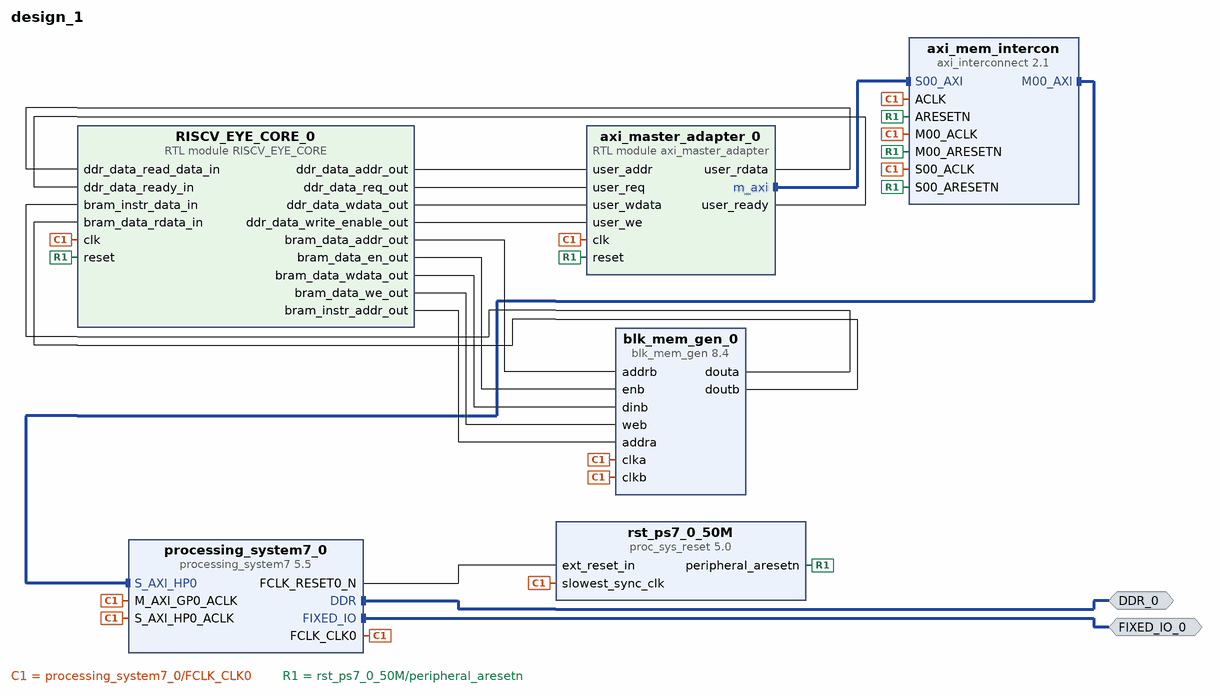
[diagram p0: block diagram of the top level]
# Vivado block design design_1, xc7z020clg400-1, Vivado 2024.2
create_bd_design design_1

create_bd_intf_port -mode Master -vlnv xilinx.com:interface:ddrx_rtl:1.0 DDR_0
create_bd_intf_port -mode Master -vlnv xilinx.com:display_processing_system7:fixedio_rtl:1.0 FIXED_IO_0

create_bd_cell -type ip -vlnv xilinx.com:ip:blk_mem_gen:8.4 blk_mem_gen_0
set_property -dict [list \
  CONFIG.Assume_Synchronous_Clk false \
  CONFIG.Coe_File test.coe \
  CONFIG.Fill_Remaining_Memory_Locations false \
  CONFIG.Load_Init_File true \
  CONFIG.Memory_Type True_Dual_Port_RAM \
  CONFIG.Write_Depth_A 1024 \
  CONFIG.use_bram_block Stand_Alone \
] [get_bd_cells blk_mem_gen_0]
create_bd_cell -type module -reference axi_master_adapter axi_master_adapter_0
create_bd_cell -type ip -vlnv xilinx.com:ip:processing_system7:5.5 processing_system7_0
set_property -dict [list \
  CONFIG.PCW_APU_PERIPHERAL_FREQMHZ 667 \
  CONFIG.PCW_ENET0_ENET0_IO {MIO 16 .. 27} \
  CONFIG.PCW_ENET0_GRP_MDIO_ENABLE 1 \
  CONFIG.PCW_ENET0_GRP_MDIO_IO {MIO 52 .. 53} \
  CONFIG.PCW_ENET0_PERIPHERAL_ENABLE 1 \
  CONFIG.PCW_ENET0_RESET_ENABLE 0 \
  CONFIG.PCW_ENET_RESET_ENABLE 1 \
  CONFIG.PCW_ENET_RESET_SELECT {Share reset pin} \
  CONFIG.PCW_FPGA0_PERIPHERAL_FREQMHZ 50 \
  CONFIG.PCW_GPIO_MIO_GPIO_ENABLE 1 \
  CONFIG.PCW_GPIO_MIO_GPIO_IO MIO \
  CONFIG.PCW_I2C_RESET_ENABLE 1 \
  CONFIG.PCW_PRESET_BANK1_VOLTAGE {LVCMOS 1.8V} \
  CONFIG.PCW_QSPI_GRP_FBCLK_ENABLE 1 \
  CONFIG.PCW_QSPI_GRP_FBCLK_IO {MIO 8} \
  CONFIG.PCW_QSPI_GRP_SINGLE_SS_ENABLE 1 \
  CONFIG.PCW_QSPI_GRP_SINGLE_SS_IO {MIO 1 .. 6} \
  CONFIG.PCW_QSPI_PERIPHERAL_ENABLE 1 \
  CONFIG.PCW_QSPI_QSPI_IO {MIO 1 .. 6} \
  CONFIG.PCW_SD0_GRP_CD_ENABLE 1 \
  CONFIG.PCW_SD0_GRP_CD_IO {MIO 47} \
  CONFIG.PCW_SD0_GRP_WP_ENABLE 0 \
  CONFIG.PCW_SD0_PERIPHERAL_ENABLE 1 \
  CONFIG.PCW_SD0_SD0_IO {MIO 40 .. 45} \
  CONFIG.PCW_SDIO_PERIPHERAL_FREQMHZ 50 \
  CONFIG.PCW_SINGLE_QSPI_DATA_MODE x4 \
  CONFIG.PCW_UART1_PERIPHERAL_ENABLE 1 \
  CONFIG.PCW_UART1_UART1_IO {MIO 48 .. 49} \
  CONFIG.PCW_UART_PERIPHERAL_FREQMHZ 100 \
  CONFIG.PCW_UIPARAM_DDR_FREQ_MHZ 533.333333 \
  CONFIG.PCW_UIPARAM_DDR_MEMORY_TYPE {DDR 3 (Low Voltage)} \
  CONFIG.PCW_UIPARAM_DDR_PARTNO {MT41K256M16 RE-125} \
  CONFIG.PCW_USB0_PERIPHERAL_ENABLE 1 \
  CONFIG.PCW_USB0_RESET_ENABLE 1 \
  CONFIG.PCW_USB0_RESET_IO {MIO 46} \
  CONFIG.PCW_USB0_USB0_IO {MIO 28 .. 39} \
  CONFIG.PCW_USB_RESET_ENABLE 1 \
  CONFIG.PCW_USB_RESET_SELECT {Share reset pin} \
  CONFIG.PCW_USE_S_AXI_HP0 1 \
] [get_bd_cells processing_system7_0]
# 296 more settings of processing_system7_0 are not shown: defaults, MIO pin electricals, DDR timing, and values the tool derives
create_bd_cell -type ip -vlnv xilinx.com:ip:axi_interconnect:2.1 axi_mem_intercon
set_property -dict {CONFIG.NUM_MI 1} [get_bd_cells axi_mem_intercon]
create_bd_cell -type ip -vlnv xilinx.com:ip:proc_sys_reset:5.0 rst_ps7_0_50M
create_bd_cell -type module -reference RISCV_EYE_CORE RISCV_EYE_CORE_0

# ---- connections ----

connect_bd_intf_net [get_bd_intf_pins axi_master_adapter_0/m_axi] [get_bd_intf_pins axi_mem_intercon/S00_AXI]
connect_bd_intf_net [get_bd_intf_pins axi_mem_intercon/M00_AXI] [get_bd_intf_pins processing_system7_0/S_AXI_HP0]
connect_bd_intf_net [get_bd_intf_ports DDR_0] [get_bd_intf_pins processing_system7_0/DDR]
connect_bd_intf_net [get_bd_intf_ports FIXED_IO_0] [get_bd_intf_pins processing_system7_0/FIXED_IO]
connect_bd_net [get_bd_pins RISCV_EYE_CORE_0/bram_data_addr_out] [get_bd_pins blk_mem_gen_0/addrb]
connect_bd_net [get_bd_pins RISCV_EYE_CORE_0/bram_data_en_out] [get_bd_pins blk_mem_gen_0/enb]
connect_bd_net [get_bd_pins RISCV_EYE_CORE_0/bram_data_wdata_out] [get_bd_pins blk_mem_gen_0/dinb]
connect_bd_net [get_bd_pins RISCV_EYE_CORE_0/bram_data_we_out] [get_bd_pins blk_mem_gen_0/web]
connect_bd_net [get_bd_pins RISCV_EYE_CORE_0/bram_instr_addr_out] [get_bd_pins blk_mem_gen_0/addra]
connect_bd_net [get_bd_pins RISCV_EYE_CORE_0/ddr_data_addr_out] [get_bd_pins axi_master_adapter_0/user_addr]
connect_bd_net [get_bd_pins RISCV_EYE_CORE_0/ddr_data_req_out] [get_bd_pins axi_master_adapter_0/user_req]
connect_bd_net [get_bd_pins RISCV_EYE_CORE_0/ddr_data_wdata_out] [get_bd_pins axi_master_adapter_0/user_wdata]
connect_bd_net [get_bd_pins RISCV_EYE_CORE_0/ddr_data_write_enable_out] [get_bd_pins axi_master_adapter_0/user_we]
connect_bd_net [get_bd_pins axi_master_adapter_0/user_rdata] [get_bd_pins RISCV_EYE_CORE_0/ddr_data_read_data_in]
connect_bd_net [get_bd_pins axi_master_adapter_0/user_ready] [get_bd_pins RISCV_EYE_CORE_0/ddr_data_ready_in]
connect_bd_net [get_bd_pins blk_mem_gen_0/douta] [get_bd_pins RISCV_EYE_CORE_0/bram_instr_data_in]
connect_bd_net [get_bd_pins blk_mem_gen_0/doutb] [get_bd_pins RISCV_EYE_CORE_0/bram_data_rdata_in]
connect_bd_net -net clk_wiz_clk_out1 [get_bd_pins processing_system7_0/FCLK_CLK0] \
  [get_bd_pins blk_mem_gen_0/clka] [get_bd_pins blk_mem_gen_0/clkb] [get_bd_pins axi_mem_intercon/S00_ACLK] \
  [get_bd_pins processing_system7_0/S_AXI_HP0_ACLK] [get_bd_pins axi_mem_intercon/M00_ACLK] \
  [get_bd_pins axi_mem_intercon/ACLK] [get_bd_pins processing_system7_0/M_AXI_GP0_ACLK] \
  [get_bd_pins axi_master_adapter_0/clk] [get_bd_pins rst_ps7_0_50M/slowest_sync_clk] [get_bd_pins RISCV_EYE_CORE_0/clk]
connect_bd_net [get_bd_pins processing_system7_0/FCLK_RESET0_N] [get_bd_pins rst_ps7_0_50M/ext_reset_in]
connect_bd_net [get_bd_pins rst_ps7_0_50M/peripheral_aresetn] \
  [get_bd_pins axi_mem_intercon/S00_ARESETN] [get_bd_pins axi_mem_intercon/M00_ARESETN] \
  [get_bd_pins axi_mem_intercon/ARESETN] [get_bd_pins axi_master_adapter_0/reset] [get_bd_pins RISCV_EYE_CORE_0/reset]

# ---- address map ----
assign_bd_address -offset 0x00000000 -range 1G -target_address_space [get_bd_addr_spaces axi_master_adapter_0/m_axi] [get_bd_addr_segs processing_system7_0/S_AXI_HP0/HP0_DDR_LOWOCM]

validate_bd_design
save_bd_design
